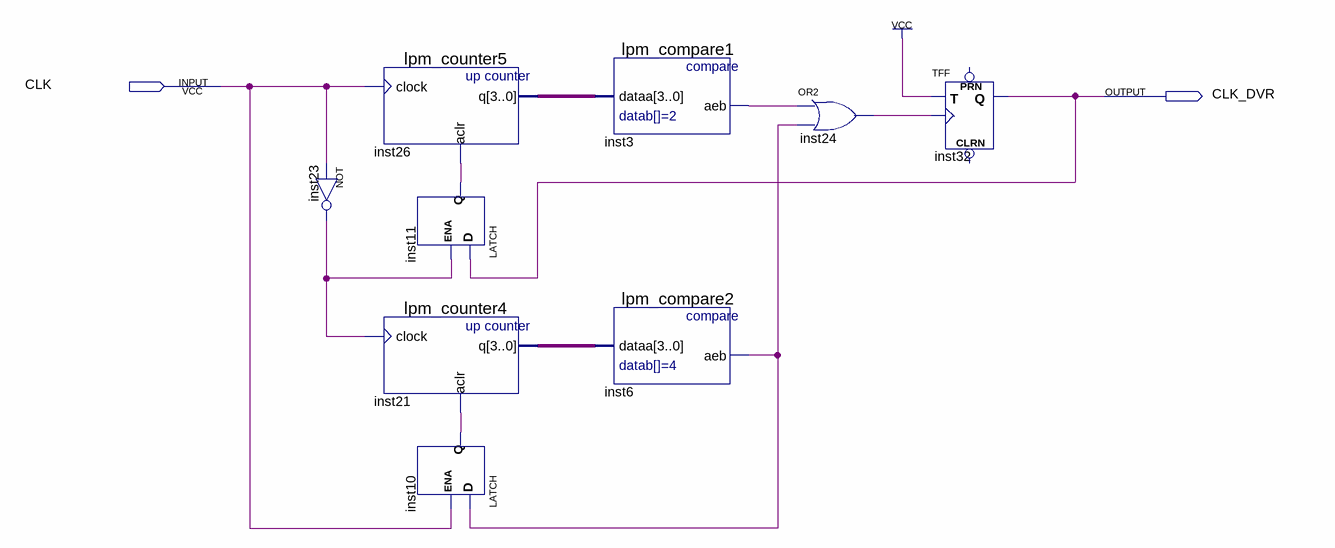
[diagram p0: schematic sheet]
// Quartus schematic DIVIDER.bdf as structural Verilog: 9 symbols, 2 pins
module DIVIDER (
  input  CLK,
  output CLK_DVR
);

  wire inst3_aeb, inst6_aeb, inst10_q, inst11_q, inst23_out, inst24_out;
  wire [3:0] inst21_q, inst26_q;

  not inst23 (inst23_out, CLK);
  lpm_counter5 inst26 (.clock(CLK), .aclr(inst11_q), .q(inst26_q));
  LATCH inst11 (.D(CLK_DVR), .ENA(inst23_out), .Q(inst11_q));
  lpm_counter4 inst21 (.clock(inst23_out), .aclr(inst10_q), .q(inst21_q));
  LATCH inst10 (.D(inst6_aeb), .ENA(CLK), .Q(inst10_q));
  lpm_compare1 inst3 (.dataa(inst26_q), .aeb(inst3_aeb));
  lpm_compare2 inst6 (.dataa(inst21_q), .aeb(inst6_aeb));
  or inst24 (inst24_out, inst3_aeb, inst6_aeb);
  TFF inst32 (.T(1'b1), .CLK(inst24_out), .Q(CLK_DVR));  // open: PRN, CLRN
endmodule
